# EAGLE design Pinguino-PIC18 (EAGLE 7.2.0)
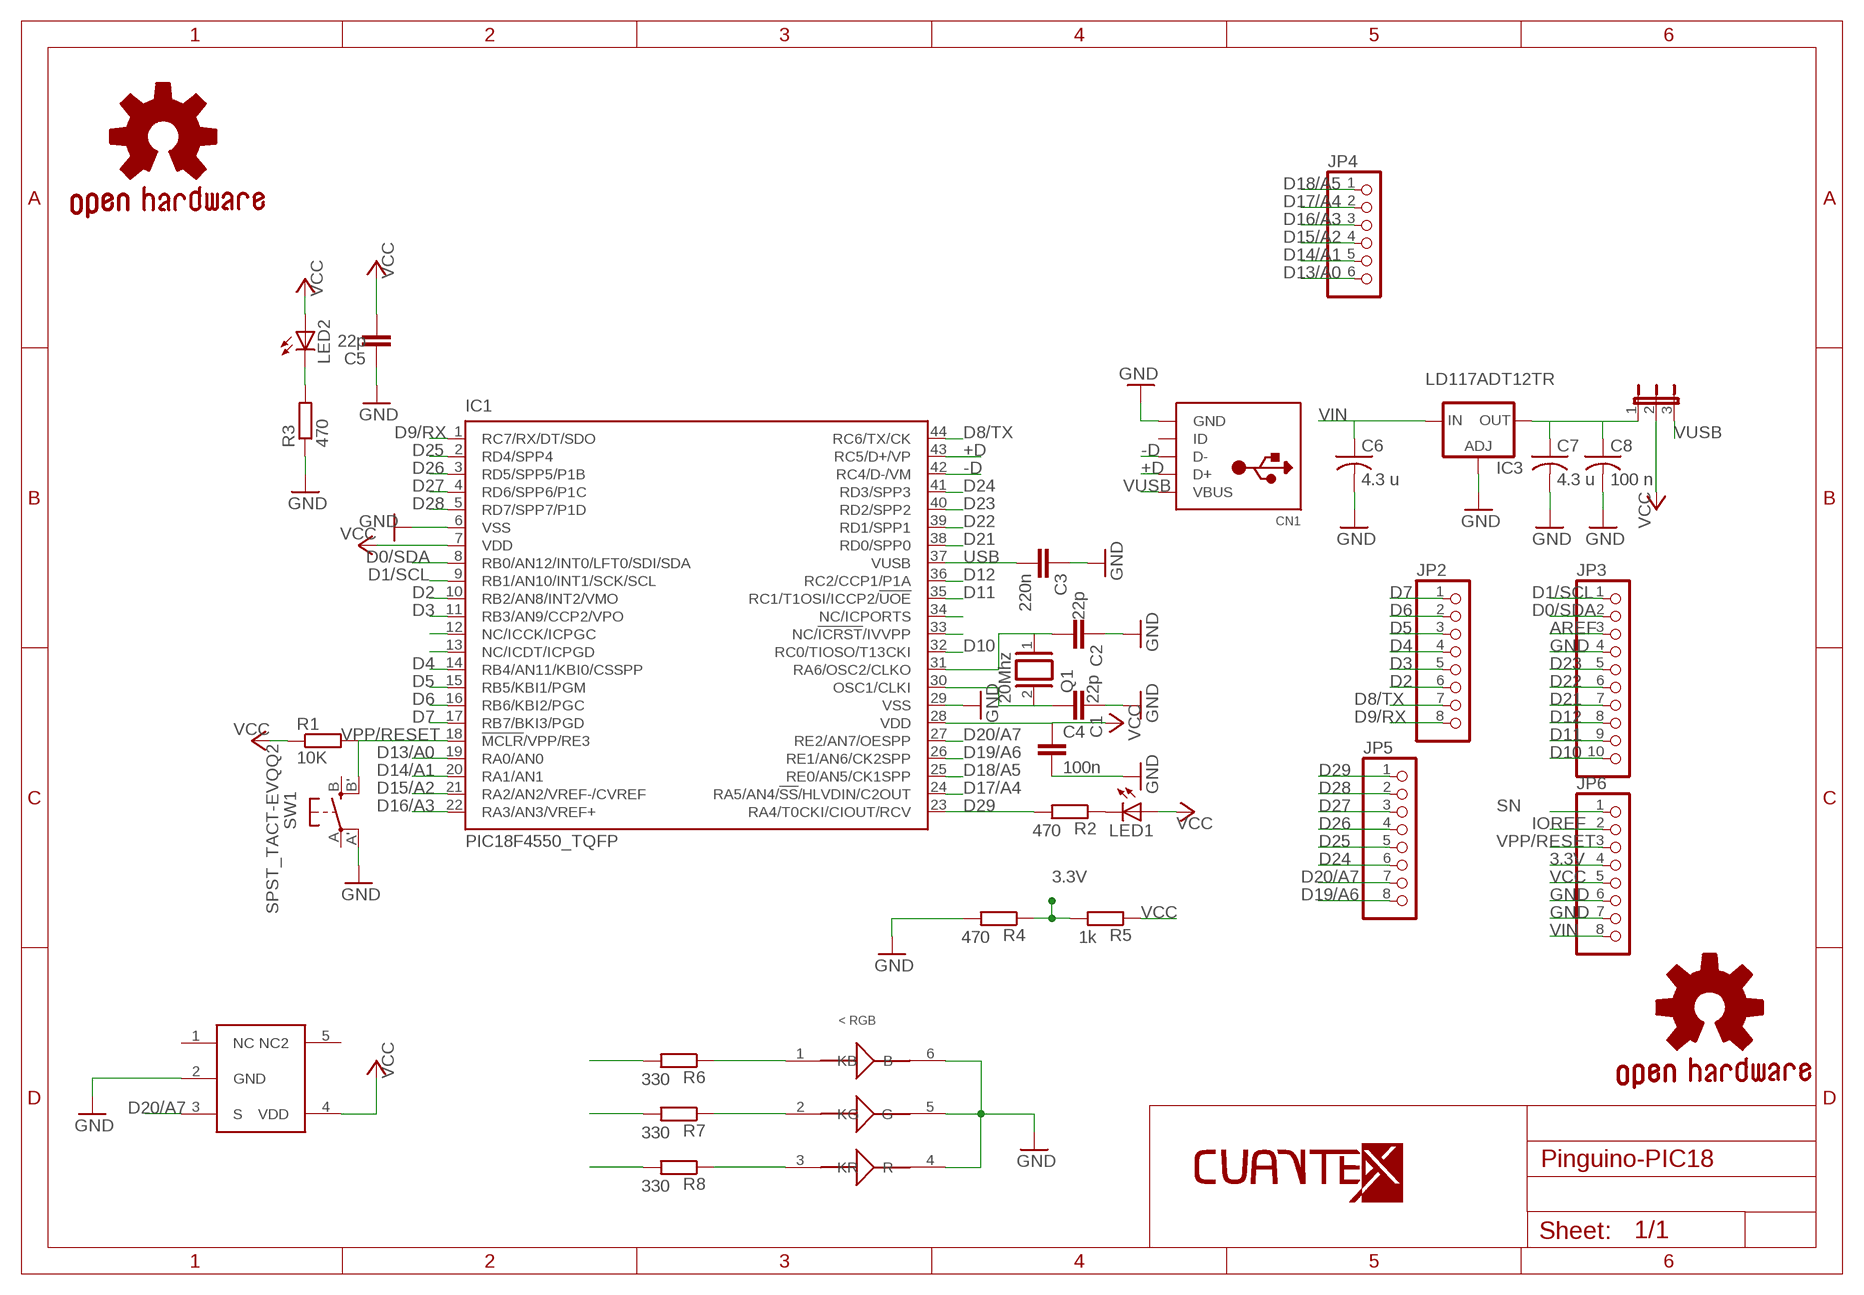
[diagram p0: schematic, sheet 1]

## Parts
C1  22p  CC0603  [C0603]
C2  22p  CC0603  [C0603]
C3  220n  CC0603  [C0603]
C4  100n  CC0603  [C0603]
C5  22p  CC0603  [C0603]
C6  4.3 u  C-USC1206K  [C1206K]
C7  4.3 u  C-USC1206K  [C1206K]
C8  100 n  C-USC0603K  [C0603K]
CN1  USBMINIB  [USB-MINIB]
GOLD_ORB_SM1  OSHWLOGO_GOLD_ORB_MED  [OSHW1]
GOLD_ORB_SM2  OSHWLOGO_GOLD_ORB_SM  [OSHW2]
IC1  PIC18F4550_TQFP  [TQFP44]
IC3  LD117ADT12TR  [DPACK]
JP1  JP2E  [JP2]
JP2  PINHD-1X8  [1X08]
JP3  PINHD-1X10  [1X10]
JP4  PINHD-1X6  [1X06]
JP5  PINHD-1X8  [1X08]
JP6  PINHD-1X8  [1X08]
LED1  LED_ESML0603  [LED_SML0603]
LED2  LED_ESML0603  [LED_SML0603]
Q1  20Mhz  XTAL/S  [QS]
R1  10K  RR0603  [R0603]
R2  470  RR0603  [R0603]
R3  470  RR0603  [R0603]
R4  470  RR0603  [R0603]
R5  1k  RR0603  [R0603]
R6  330  RR0603  [R0603]
R7  330  RR0603  [R0603]
R8  330  RR0603  [R0603]
SW1  SPST_TACT-EVQQ2  [EVQ-Q2]
U$1  LOGO-TOP-30MM  [C-1]
U$3  RGB_SMD  [SMD_LED]
U$4  SC70  [SC70]

## Nets
3.3V: JP6.4 R4.1 R5.2
+D: CN1.D+ IC1.43(RC5/D+/VP)
-D: CN1.D- IC1.42(RC4/D-/VM)
AREF: JP3.3
D0/SDA: IC1.8(RB0/AN12/INT0/LFT0/SDI/SDA) JP3.2
D1/SCL: IC1.9(RB1/AN10/INT1/SCK/SCL) JP3.1
D2: IC1.10(RB2/AN8/INT2/VMO) JP2.6
D3: IC1.11(RB3/AN9/CCP2/VPO) JP2.5 R6.2
D4: IC1.14(RB4/AN11/KBI0/CSSPP) JP2.4
D5: IC1.15(RB5/KBI1/PGM) JP2.3
D6: IC1.16(RB6/KBI2/PGC) JP2.2
D7: IC1.17(RB7/BKI3/PGD) JP2.1
D8/TX: IC1.44(RC6/TX/CK) JP2.7
D9/RX: IC1.1(RC7/RX/DT/SDO) JP2.8
D10: IC1.32(RC0/TIOSO/T13CKI) JP3.10
D11: IC1.35(RC1/T1OSI/ICCP2/!UOE) JP3.9
D12: IC1.36(RC2/CCP1/P1A) JP3.8 R7.2
D13/A0: IC1.19(RA0/AN0) JP4.6
D14/A1: IC1.20(RA1/AN1) JP4.5
D15/A2: IC1.21(RA2/AN2/VREF-/CVREF) JP4.4
D16/A3: IC1.22(RA3/AN3/VREF+) JP4.3
D17/A4: IC1.24(RA5/AN4/!SS!/HLVDIN/C2OUT) JP4.2
D18/A5: IC1.25(RE0/AN5/CK1SPP) JP4.1
D19/A6: IC1.26(RE1/AN6/CK2SPP) JP5.8
D20/A7: IC1.27(RE2/AN7/OESPP) JP5.7 U$4.3(S)
D21: IC1.38(RD0/SPP0) JP3.7 R8.2
D22: IC1.39(RD1/SPP1) JP3.6
D23: IC1.40(RD2/SPP2) JP3.5
D24: IC1.41(RD3/SPP3) JP5.6
D25: IC1.2(RD4/SPP4) JP5.5
D26: IC1.3(RD5/SPP5/P1B) JP5.4
D27: IC1.4(RD6/SPP6/P1C) JP5.3
D28: IC1.5(RD7/SPP7/P1D) JP5.2
D29: IC1.23(RA4/T0CKI/CIOUT/RCV) JP5.1 R2.2
GND: C1.1 C2.1 C3.1 C4.2 C5.1 C6.2 C7.2 C8.2 CN1.GND IC1.6(VSS) IC1.29(VSS) IC3.1(ADJ) JP3.4 JP6.6 JP6.7 R3.1 R4.2 SW1.A'(P1) U$3.4(R) U$3.5(G) U$3.6(B) U$4.2(GND)
IOREF: JP6.2
N$1: C1.2 IC1.30(OSC1/CLKI) Q1.2
N$3: C2.2 IC1.31(RA6/OSC2/CLKO) Q1.1
N$5: LED1.C R2.1
N$7: LED2.C R3.2
N$8: C7.1 C8.1 IC3.4(OUT) JP1.1
N$10: R6.1 U$3.1(KB)
N$11: R7.1 U$3.2(KG)
N$12: R8.1 U$3.3(KR)
N$45: IC1.12(NC/ICCK/ICPGC)
N$46: IC1.13(NC/ICDT/ICPGD)
N$47: IC1.34(NC/ICPORTS)
N$48: IC1.33(NC/!ICRST!/IVVPP)
SN: JP6.1
USB: C3.2 IC1.37(VUSB)
VCC: C4.1 C5.2 IC1.7(VDD) IC1.28(VDD) JP1.2 JP6.5 LED1.A LED2.A R1.1 R5.1 U$4.4(VDD)
VIN: C6.1 IC3.3(IN) JP6.8
VPP/RESET: IC1.18(!MCLR!/VPP/RE3) JP6.3 R1.2 SW1.B'(S1)
VUSB: CN1.VBUS JP1.3
Unconnected: CN1.ID SW1.A(P) SW1.B(S) U$4.1(NC) U$4.5(NC2)

## Library data of the parts
C1-C5 = eagle-ltspice:C: CAPACITOR, European symbol; SPICEMODEL: NONE; SPICEPREFIX: C
C6-C8 = adafruit:C-US: CAPACITOR, American symbol
CN1 = adafruit:USB: USB Connectors USBMINIB - Surface Mount Female Mini-B USB Connector 4UConnector: 06564 By microbuilder.eu Thru-hole RA Female Mini-B USB Connector 4UConnector: 18732 By ladyada.net
GOLD_ORB_SM1 GOLD_ORB_SM2 = OPENHW:OSHWLOGO: These are Open-Source Hardware logos.
IC1 = microchip:PIC18F4*_TQFP: USB Microcontrollers with nanoWatt Technology High-Performance, Enhanced Flash, 28/40/44-Pin, Source: http://ww1.microchip.com/downloads/en/devicedoc/39632c.pdf; MF: MICROCHIP; MPN: PIC18F4550-I/PT; OC_FARNELL: 9321365; OC_NEWARK: 08J9633
IC3 = v-reg:LD117A?*: Low drop fixed and adjustable positive voltage regulators 1 A Source: http://www.st.com/stonline/products/literature/ds/7194/ld1117axx.pdf
JP1 = jumper:JP2E: JUMPER
JP2 JP5 JP6 = pinhead:PINHD-1X8: PIN HEADER
JP3 = pinhead:PINHD-1X10: PIN HEADER
JP4 = pinhead:PINHD-1X6: PIN HEADER
LED1 LED2 = eagle-ltspice:LED_E: LED Source: http://www.osram.convergy.de Source: www.luxeon.com Source: www.kingbright.com; SPICEMODEL: NONE; SPICEPREFIX: D; SPICETYPE: diode
Q1 = special:XTAL/S: CRYSTAL
R1-R8 = eagle-ltspice:R: RESISTOR, European symbol; SPICEMODEL: NONE; SPICEPREFIX: R
SW1 = adafruit:SPST_TACT: SMT 6mm switch, EVQQ2 series http://www.ladyada.net/library/eagle
U$1 = LOGOTIPOS:LOGO-TOP-30MM
U$3 = RGB_smdHeTPro:RGB_SMD
U$4 = MCP9700:SC70: Sensor de Temperatura MCP9700 SC70 Rolando Ramiez Rosales HeTPro

## Board
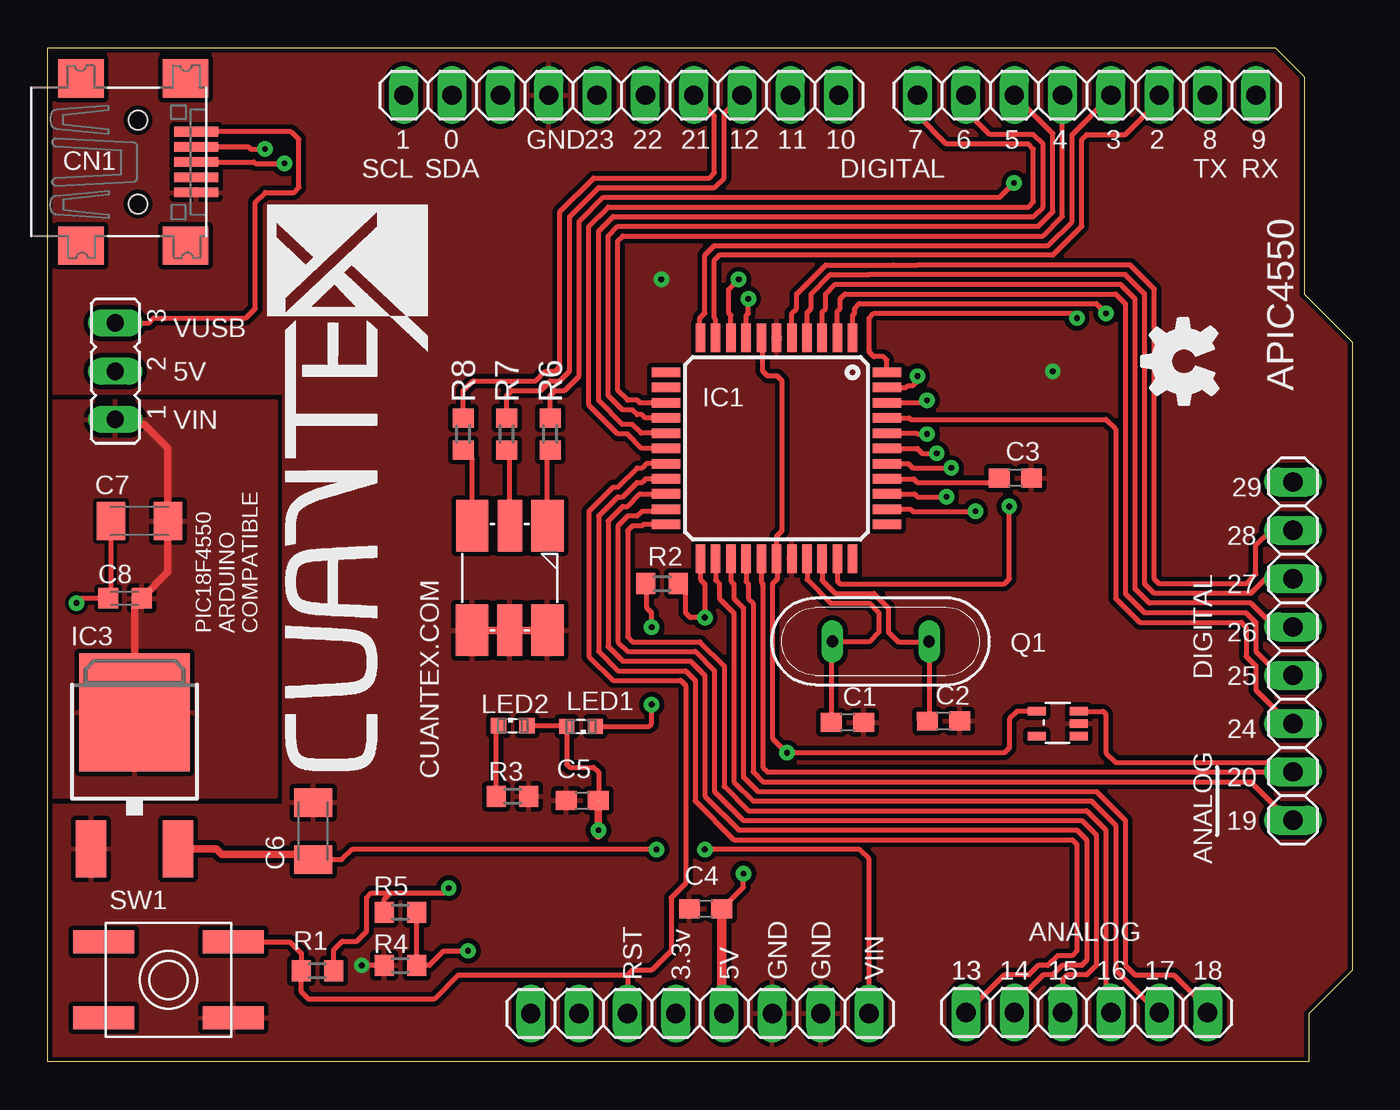
[diagram p1: board, top side]
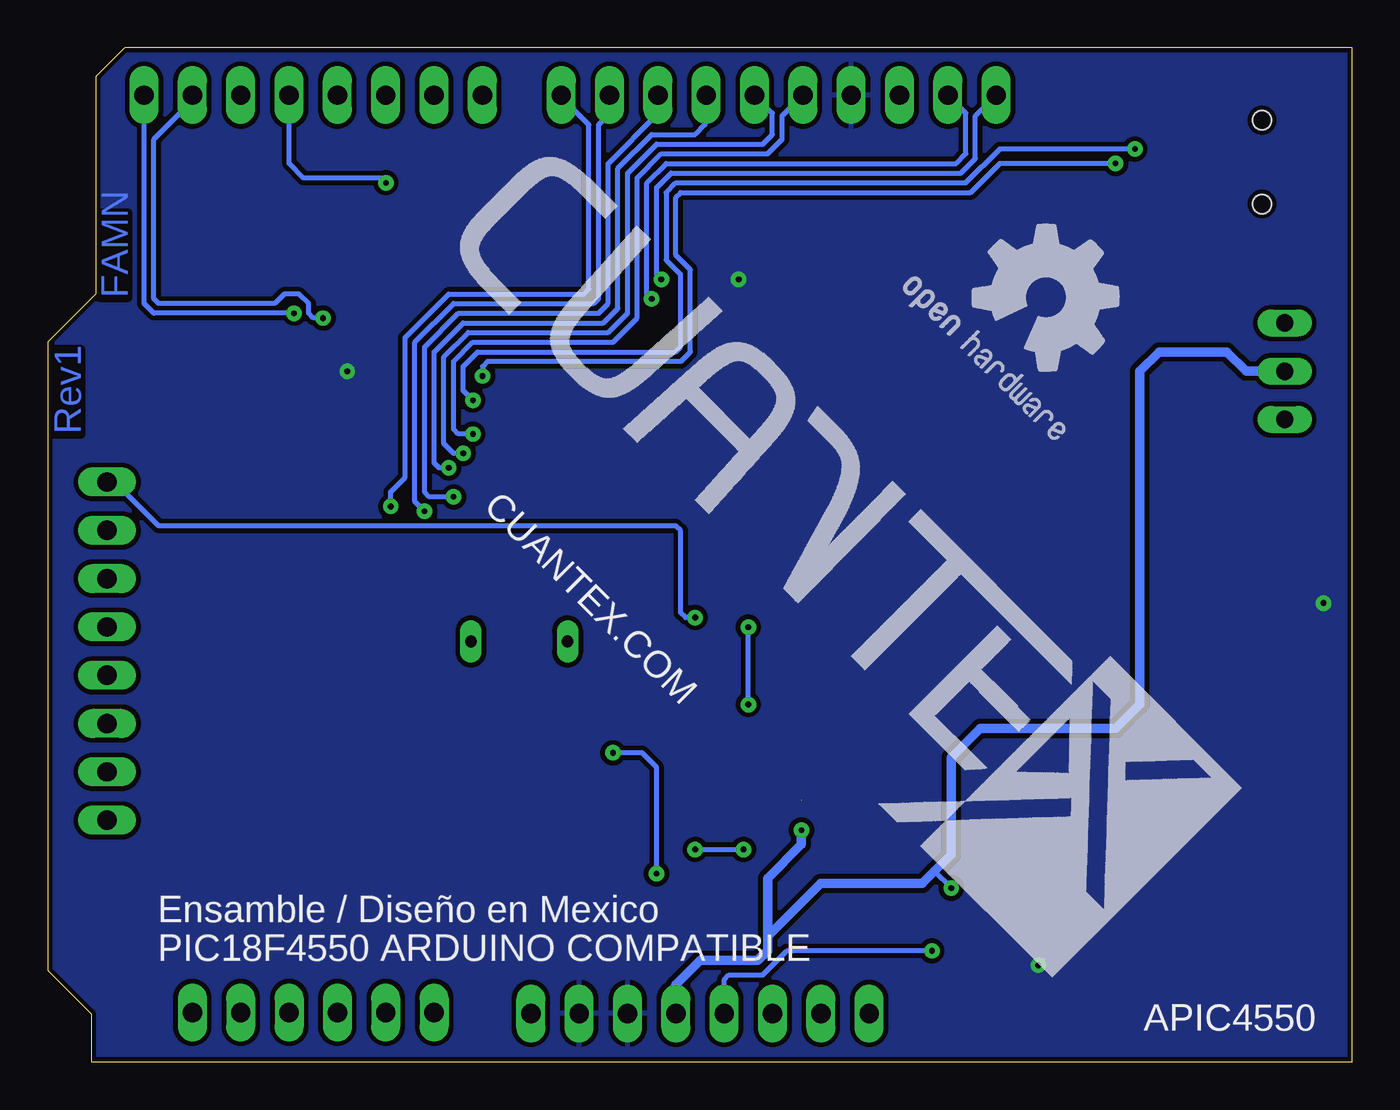
[diagram p2: board, bottom side, seen from below]

Size 68.58 x 53.34 mm. Coordinates in mm from the lower left corner, seen from the top.
Outline: 0,53.34 64.52,53.34 66.04,51.82 66.04,40.39 68.58,37.85 68.58,4.83 66.29,2.54 66.29,0 0,0 0,53.34
Copper layers (1*16): Top 0.035mm / dielectric 1.5mm / Bottom 0.035mm
Design rules "cuantex2layerdrc": minimum track width 8mil, minimum drill 0.3mm, track to track 8mil, track to pad 8mil, pad to pad 8mil, via to via 8mil, smd to smd 8mil, copper to edge 10mil, drill to drill 10mil, minimum pad ring 10mil, minimum via ring 10mil, stop-mask expansion 4mil, vias tented up to drill 0mil, thermal gap 10mil

### Footprints (pad centres in the part's own frame; a part is rotated, then mirrored left to right if it is on the bottom)
C0603 = smd 1.1 x 1: 1 -0.85,0; 2 0.85,0
C1206K = smd 1.5 x 2: 1 -1.5,0; 2 1.5,0
C0603K = smd 1.05 x 1.08: 1 -0.875,0; 2 0.875,0
USB-MINIB = smd 0.5 x 2.308: D+ 0,4.064; D- -0.8,4.064; GND 1.6,4.064; ID 0.8,4.064; VBUS -1.6,4.064 | smd 2 x 2.4: GND1 -4.4,-2; GND2 -4.4,3.5; GND3 4.4,3.5; GND4 4.4,-2 | hole 1: -2.2,1; 2.2,1
TQFP44 = smd 1.5 x 0.5: 1 -5.8,4; 2 -5.8,3.2; 3 -5.8,2.4; 4 -5.8,1.6; 5 -5.8,0.8; 6 -5.8,0; 7 -5.8,-0.8; 8 -5.8,-1.6; 9 -5.8,-2.4; 10 -5.8,-3.2; 11 -5.8,-4; 23 5.8,-4; 24 5.8,-3.2; 25 5.8,-2.4; 26 5.8,-1.6; 27 5.8,-0.8; 28 5.8,0; 29 5.8,0.8; 30 5.8,1.6; 31 5.8,2.4; 32 5.8,3.2; 33 5.8,4 | smd 0.5 x 1.5: 12 -4,-5.8; 13 -3.2,-5.8; 14 -2.4,-5.8; 15 -1.6,-5.8; 16 -0.8,-5.8; 17 0,-5.8; 18 0.8,-5.8; 19 1.6,-5.8; 20 2.4,-5.8; 21 3.2,-5.8; 22 4,-5.8; 34 4,5.8; 35 3.2,5.8; 36 2.4,5.8; 37 1.6,5.8; 38 0.8,5.8; 39 0,5.8; 40 -0.8,5.8; 41 -1.6,5.8; 42 -2.4,5.8; 43 -3.2,5.8; 44 -4,5.8
DPACK = smd 1.6 x 3: 1 -2.28,-4.8; 3 2.28,-4.8 | smd 5.8 x 6.2: 4 0,2.38
JP2 = drill 0.914 long: 1 -2.54,0; 2 0,0; 3 2.54,0
1X08 = drill 1.016 long: 1 -8.89,0; 2 -6.35,0; 3 -3.81,0; 4 -1.27,0; 5 1.27,0; 6 3.81,0; 7 6.35,0; 8 8.89,0
1X10 = drill 1.016 long: 1 -11.43,0; 2 -8.89,0; 3 -6.35,0; 4 -3.81,0; 5 -1.27,0; 6 1.27,0; 7 3.81,0; 8 6.35,0; 9 8.89,0; 10 11.43,0
1X06 = drill 1.016 long: 1 -6.35,0; 2 -3.81,0; 3 -1.27,0; 4 1.27,0; 5 3.81,0; 6 6.35,0
LED_SML0603 = smd 0.8 x 0.8: A 0.75,0; C -0.75,0
QS = drill 0.61 long: 1 -2.54,0; 2 2.54,0
R0603 = smd 1 x 1.1: 1 -0.85,0; 2 0.85,0
EVQ-Q2 = smd 3.2 x 1.2: A -3.4,-2; A' 3.4,-2; B -3.4,2; B' 3.4,2
SMD_LED = smd 2.7 x 1.7: 1 -2.8,1.89; 3 -2.8,-2.06; 4 2.7,-2.07; 6 2.7,1.89 | smd 2.7 x 1.3: 2 -2.8,-0.08; 5 2.7,-0.09
SC70 = smd 0.45 x 0.95: 1 0.64,1.11; 2 -0.01,1.11; 3 -0.66,1.11; 4 -0.66,-1.09; 5 0.64,-1.09

### Placement (x,y rotation side)
C1  42.04,17.86 180 top
C2  47.09,17.93 180.4 top
C3  50.86,30.71 180 top
C4  34.59,8.05 180 top
C5  28.1,13.75 0 top
C6  13.96,12.15 90 top
C7  4.83,28.45 180 top
C8  4.06,24.38 180 top
CN1  3.75,47.32 270 top
GOLD_ORB_SM1  25.65,39.67 315 bottom
GOLD_ORB_SM2  64.01,33.02 90 top
IC1  38.31,32.26 270 top
IC3  4.57,16 0 top
JP1  3.56,36.32 90 top
JP2  54.62,50.84 0 top
JP3  30.15,50.84 0 top
JP4  54.62,2.61 180 top
JP5  65.45,21.6 270 top
JP6  34.29,2.56 0 top
LED1  28.03,17.64 180 top
LED2  24.45,17.69 0 top
Q1  43.79,22.11 180 top
R1  14.18,4.8 180 top
R2  32.3,25.15 0 top
R3  24.44,13.97 180 top
R4  18.54,5.08 180 top
R5  18.54,7.87 0 top
R6  26.42,33.02 90 top
R7  24.13,33.02 90 top
R8  21.84,33.02 90 top
SW1  6.35,4.32 0 top
U$1  20.07,15.24 90 top
U$2  LOGO-TOP-40MM  [C-3]  51.15,39.64 315 bottom
U$3  24.38,25.4 270 top
U$4  53.09,17.78 270 top

### Tracks (layer width: path | path; a pad name or v marks a point on that pad's centre or on a via)
3.3V  (via drill 0.3)
  Top 0.254: v22.1,5.84 20.83,5.84 20.07,5.08 R4.1 R5.2
  Bottom 0.254: JP6.4 33.02,4.32 32.77,4.57 30.99,4.57 29.72,5.84 v22.1,5.84
+D  (via drill 0.3)
  Top 0.254: CN1.D+ 10.85,47.31 10.92,47.24 v12.45,47.24 | IC1.43 45.12,35.47 45.21,35.56 45.47,35.56 45.72,35.81 v45.72,36.07
  Bottom 0.254: v12.45,47.24 18.54,47.24 20.07,45.72 35.31,45.72 35.56,45.47 35.56,42.42 34.8,41.66 34.8,37.34 35.31,36.83 45.47,36.83 45.72,36.58 v45.72,36.07
-D  (via drill 0.3)
  Top 0.254: IC1.42 46.09,34.66 v46.23,34.8 | CN1.D- 10.56,48.12 10.67,48.01 v11.43,48.01
  Bottom 0.254: v11.43,48.01 18.54,48.01 20.32,46.23 35.56,46.23 36.07,45.72 36.07,42.16 35.31,41.4 35.31,37.59 35.56,37.34 45.97,37.34 46.74,36.58 46.74,35.31 v46.23,34.8
D0/SDA  (via drill 0.3)
  Top 0.254: IC1.8 36.71,39.25 36.83,39.37 v36.83,40.13
  Bottom 0.254: v36.83,40.13 37.08,40.39 37.08,46.23 36.07,47.24 20.83,47.24 20.32,47.75 20.32,49.89 JP3.2
D1/SCL  (via drill 0.3)
  Top 0.254: IC1.9 35.91,39.27 35.81,39.37 35.81,40.64 v36.32,41.15
  Bottom 0.254: JP3.1 19.81,49.75 19.81,47.5 20.57,46.74 35.81,46.74 36.58,45.97 36.58,41.4 v36.32,41.15
D2
  Top 0.254: IC1.10 35.11,39.05 35.05,39.12 35.05,42.16 35.31,42.42 52.83,42.42 54.36,43.94 54.36,48.51 54.61,48.77 56.64,48.77 58.43,50.56 JP2.6
D3  (via drill 0.3)
  Top 0.254: IC1.11 34.31,38.08 34.29,38.1 34.29,39.12 34.54,39.37 34.54,42.42 35.05,42.93 52.58,42.93 53.85,44.2 53.85,48.77 55.89,50.81 JP2.5 55.88,50.83 | R6.2 26.42,35.05 26.67,35.31 27.18,35.31 27.94,36.07 27.94,44.2 29.21,45.47 50.04,45.47 v50.8,46.23
  Bottom 0.254: v50.8,46.23 51.05,46.48 55.12,46.48 55.89,47.25 JP2.5
D4
  Top 0.254: JP2.4 53.34,50.83 53.34,44.45 52.32,43.43 30.23,43.43 29.97,43.18 29.97,35.31 30.48,34.8 30.99,34.8 31.12,34.66 IC1.14
D5
  Top 0.254: JP2.3 52.83,48.81 52.83,44.7 52.07,43.94 29.97,43.94 29.46,43.43 29.46,35.05 30.23,34.29 30.73,34.29 30.99,34.04 31.24,34.04 31.41,33.87 IC1.15
D6
  Top 0.254: IC1.16 31.2,33.06 30.73,33.53 30.23,33.53 28.96,34.8 28.96,43.69 29.72,44.45 51.82,44.45 52.32,44.96 52.32,48.26 51.82,48.77 49.53,48.77 48.27,50.03 JP2.2
D7
  Top 0.254: IC1.17 31.23,32.27 30.48,33.02 29.97,33.02 28.45,34.54 28.45,43.94 29.46,44.96 51.56,44.96 51.82,45.21 51.82,48.01 51.56,48.26 47.24,48.26 45.73,49.77 JP2.1
D8/TX  (via drill 0.3)
  Top 0.254: IC1.44 44.11,36.91 43.94,37.08 43.43,37.08 43.18,37.34 43.18,39.12 43.43,39.37 53.85,39.37 v54.1,39.12
  Bottom 0.254: JP2.7 61.47,50.34 61.47,50.04 62.99,48.51 62.99,40.13 62.74,39.88 56.64,39.88 56.13,40.39 55.37,40.39 54.86,39.88 54.86,39.37 54.61,39.12 v54.1,39.12
D9/RX  (via drill 0.3)
  Top 0.254: IC1.1 42.31,39.27 42.42,39.37 42.42,39.62 42.67,39.88 55.12,39.88 v55.63,39.37
  Bottom 0.254: JP2.8 63.5,50.83 63.5,39.88 62.99,39.37 v55.63,39.37
D10  (via drill 0.3)
  Top 0.254: IC1.32 41.51,25.29 41.66,25.15 50.29,25.15 50.55,25.4 v50.55,29.21
  Bottom 0.254: JP3.10 41.58,50.73 40.13,49.28 40.13,40.64 40.39,40.39 47.5,40.39 49.78,38.1 49.78,30.73 50.55,29.97 v50.55,29.21
D11  (via drill 0.3)
  Top 0.254: IC1.35 45.36,29.07 45.47,28.96 v48.77,28.96
  Bottom 0.254: v48.77,28.96 49.28,29.46 49.28,37.85 47.24,39.88 39.88,39.88 39.62,40.13 39.62,49.28 39.04,49.86 JP3.9
D12  (via drill 0.3)
  Top 0.254: IC1.36 45.57,29.87 45.72,29.72 v47.24,29.72 | R7.2 24.13,35.05 24.38,35.31 25.91,35.31 26.42,35.81 26.92,35.81 27.43,36.32 27.43,44.45 28.96,45.97 35.05,45.97 35.56,46.48 35.56,49.89 JP3.8
  Bottom 0.254: v47.24,29.72 48.51,29.72 48.77,29.97 48.77,37.59 46.99,39.37 39.62,39.37 39.12,39.88 39.12,47.24 36.5,49.86 JP3.8
D13/A0
  Top 0.254: IC1.19 31.43,30.66 31.24,30.48 30.99,30.48 30.23,29.72 29.97,29.72 28.96,28.7 28.96,21.59 29.97,20.57 33.53,20.57 34.04,20.07 34.04,13.72 36.07,11.68 53.85,11.68 54.1,11.43 54.1,5.84 53.85,5.59 53.09,5.59 52.58,5.08 52.07,5.08 51.56,4.57 50.29,4.57 48.77,3.05 48.71,3.05 JP4.6
D14/A1
  Top 0.254: IC1.20 31.13,29.87 30.48,29.21 30.23,29.21 29.46,28.45 29.46,21.84 30.23,21.08 33.78,21.08 34.54,20.32 34.54,13.97 36.32,12.19 54.1,12.19 54.61,11.68 54.61,5.33 54.36,5.08 53.34,5.08 52.83,4.57 52.32,4.57 50.8,3.05 JP4.5
D15/A2
  Top 0.254: IC1.21 32.41,28.96 31.24,28.96 30.99,28.7 30.48,28.7 29.97,28.19 29.97,22.1 30.48,21.59 34.04,21.59 35.05,20.57 35.05,14.22 36.58,12.7 54.36,12.7 55.12,11.94 55.12,5.08 54.61,4.57 53.59,4.57 53.34,4.32 53.35,4.31 JP4.4
D16/A3
  Top 0.254: IC1.22 31.31,28.27 31.24,28.19 30.73,28.19 30.48,27.94 30.48,22.35 30.73,22.1 34.29,22.1 35.56,20.83 35.56,14.48 36.83,13.21 54.61,13.21 55.63,12.19 55.63,2.87 JP4.3
D17/A4
  Top 0.254: IC1.24 35.11,25.34 35.31,25.15 35.31,24.38 36.07,23.62 36.07,14.73 37.08,13.72 54.86,13.72 56.13,12.45 56.13,4.83 58.35,2.61 JP4.2
D18/A5
  Top 0.254: IC1.25 35.91,25.3 36.07,25.15 36.07,24.38 36.58,23.88 36.58,14.99 37.34,14.22 55.12,14.22 56.64,12.7 56.64,5.08 57.15,4.57 59.18,4.57 60.97,2.78 JP4.1
D19/A6
  Top 0.254: IC1.26 36.71,25.26 36.83,25.15 36.83,24.38 37.08,24.13 37.08,15.24 37.59,14.73 63.25,14.73 64.77,13.21 64.95,13.21 JP5.8
D20/A7
  Top 0.254: IC1.27 37.51,25.22 37.59,25.15 37.59,15.49 37.85,15.24 65.43,15.24 JP5.7 64.95,15.75 56.13,15.75 55.63,16.26 55.63,18.29 55.47,18.44 U$4.3
D21  (via drill 0.3)
  Top 0.254: IC1.38 45.24,31.47 45.47,31.24 v47.5,31.24 | R8.2 21.84,35.31 22.35,35.81 25.65,35.81 26.16,36.32 26.67,36.32 26.92,36.58 26.92,44.7 28.7,46.48 34.8,46.48 35.05,46.74 35.05,49.75 JP3.7
  Bottom 0.254: v47.5,31.24 48.01,31.24 48.26,31.5 48.26,37.34 46.74,38.86 39.37,38.86 38.61,39.62 38.61,46.99 36.83,48.77 34.54,48.77 34.04,49.28 34.04,50.76 JP3.7
D22  (via drill 0.3)
  Top 0.254: IC1.39 45.71,32.27 45.97,32 v46.74,32
  Bottom 0.254: v46.74,32 47.24,32 47.75,32.51 47.75,37.08 46.48,38.35 39.12,38.35 38.1,39.37 38.1,46.74 36.58,48.26 30.99,48.26 30.48,48.77 30.48,49.89 JP3.6
D23  (via drill 0.3)
  Top 0.254: IC1.40 45.68,33.06 45.72,33.02 v46.23,33.02
  Bottom 0.254: v46.23,33.02 46.99,33.02 47.24,33.27 47.24,36.83 46.23,37.85 38.86,37.85 37.59,39.12 37.59,46.48 36.32,47.75 30.73,47.75 29.97,48.51 29.97,49.75 JP3.5
D24
  Top 0.254: IC1.41 45.3,33.87 45.38,33.78 55.63,33.78 56.13,33.27 56.13,24.38 57.4,23.11 62.74,23.11 62.99,22.86 62.99,21.34 63.5,20.83 63.5,19.56 64.77,18.29 64.95,18.29 JP5.6
D25
  Top 0.254: IC1.2 41.51,39.48 41.66,39.62 41.66,40.13 41.91,40.39 56.13,40.39 56.64,39.88 56.64,24.64 57.66,23.62 62.99,23.62 63.5,23.11 63.5,21.59 64.75,20.34 JP5.5
D26
  Top 0.254: IC1.3 40.71,39.44 40.89,39.62 40.89,40.39 41.4,40.89 56.39,40.89 57.15,40.13 57.15,24.89 57.91,24.13 63.25,24.13 64.5,22.88 JP5.4 65.43,22.86
D27
  Top 0.254: IC1.4 39.91,39.41 40.13,39.62 40.13,40.39 41.15,41.4 41.4,41.4 43.18,41.4 56.64,41.4 57.66,40.39 57.66,25.15 58.17,24.64 63.25,24.64 64.02,25.41 JP5.3
D28
  Top 0.254: IC1.5 39.11,39.37 39.37,39.62 39.37,40.39 40.89,41.91 44.45,41.91 45.72,41.91 56.9,41.91 58.17,40.64 58.17,25.4 58.42,25.15 62.99,25.15 63.5,25.65 63.5,27.18 64.28,27.96 JP5.2
D29  (via drill 0.3)
  Top 0.254: IC1.23 34.31,25.38 34.54,25.15 v34.54,23.37 33.78,23.37 33.53,23.62 33.53,24.77 R2.2
  Bottom 0.254: v34.54,23.37 35.05,23.37 35.31,23.62 35.31,27.94 35.56,28.19 62.74,28.19 65.04,30.49 JP5.1
GND  (via drill 0.3)
  Top 0.254: C6.2 13.96,13.47 | R4.2 v16.51,5.08 | C7.2 3.33,24.52 C8.2 1.78,24.38 v1.52,24.13
  Top 0.406: U$3.4 U$3.6
  Bottom 0.254: v16.51,5.08 16.26,5.33
  other vias: 32.26,41.15 52.83,36.32
  pour Bottom (isolate 0.254): -0.54,53.46 68.46,53.46 68.46,-0.54 -0.54,-0.54
  pour Top (isolate 0.254): -0.54,53.46 68.46,53.46 68.46,-0.54 -0.54,-0.54 -0.54,13.48 12.46,13.48 12.46,35.21 -0.54,35.21
N$1
  Top 0.254: IC1.30 39.91,25.36 41.15,24.13 43.18,24.13 43.69,23.62 43.69,22.61 43.18,22.1 41.26,22.1 Q1.2 41.19,22.06 C1.2
N$3
  Top 0.254: IC1.31 40.71,25.33 41.4,24.64 43.43,24.64 44.2,23.88 44.2,22.61 44.7,22.1 46.31,22.1 Q1.1 46.33,18.01 C2.2
N$5  (via drill 0.3)
  Top 0.254: LED1.C 31.61,17.64 31.75,17.78 v31.75,18.8 | v31.75,22.86 31.75,23.62 31.5,23.88 31.5,25.1 R2.1
  Bottom 0.254: v31.75,18.8 v31.75,22.86
N$7
  Top 0.254: R3.2 23.59,17.58 LED2.C
N$8
  Top 0.406: IC3.4 4.57,24.02 C8.1 6.33,25.77 C7.1 6.33,32.28 5.08,33.53 3.81,33.53 JP1.1
  pour Top: -0.03,34.71 11.97,34.71 11.97,13.97 0.22,13.97
N$10
  Top 0.254: U$3.1 26.27,32.03 R6.1
N$11
  Top 0.254: U$3.2 24.3,32 R7.1
N$12
  Top 0.254: U$3.3 22.32,31.69 R8.1
USB
  Top 0.254: IC1.37 45.54,30.66 45.72,30.48 49.78,30.48 C3.2
VCC  (via drill 0.3)  (1 unrouted)
  Top 0.254: IC1.7 37.59,37.99 37.59,36.32 37.85,36.07 38.35,36.07 38.61,35.81 38.61,27.94 38.31,27.65 IC1.28 38.35,26.43 38.35,25.4 38.1,25.15 38.1,17.02 v38.86,16.26 50.29,16.26 50.55,16.51 50.55,18.03 50.95,18.44 U$4.4 | LED2.A 27.23,17.69 LED1.A 27.28,15.65 27.43,15.49 28.7,15.49 28.96,15.24 C5.2 | R1.1 15.04,5.89 15.49,6.35 16.26,6.35 16.76,6.86 16.76,8.64 17.02,8.89 18.03,8.89 | 18.03,8.89 20.83,8.89 v21.08,9.14 | R5.1 17.69,8.55 18.03,8.89 | C4.1 36.58,9.19 v36.58,9.91
  Top 0.406: v28.96,12.19 v28.95,12.19 C5.2
  Top 0.508: C4.1 35.44,2.68 JP6.5 | v28.96,12.19 28.95,11.94
  Bottom 0.254: v21.08,9.14 21.97,10.03 | v36.58,9.91 36.58,15.49 37.34,16.26 v38.86,16.26
  Bottom 0.508: 30.73,6.6 30.73,9.65 28.96,11.43 v28.96,12.19 | JP6.5 35.56,4.07 34.29,5.33 31.24,5.33 30.73,5.84 30.73,6.6 | JP1.2 5.59,36.32 6.6,37.34 10.16,37.34 11.18,36.32 11.18,18.8 12.45,17.53 19.56,17.53 21.08,16 21.08,10.92 21.97,10.03 22.61,9.4 27.94,9.4 30.73,6.6
VIN  (via drill 0.3)
  Top 0.254: JP6.8 43.18,10.67 42.67,11.18 v34.54,11.18 | C6.1 15.47,10.65 16,11.18 v32,11.18
  Top 0.406: IC3.3 8.86,11.2 9.14,10.92 13.69,10.92 C6.1
  Bottom 0.254: v34.54,11.18 v32,11.18
VPP/RESET
  Top 0.254: IC1.18 31.47,31.47 31.24,31.24 30.99,31.24 29.97,30.23 29.72,30.23 28.45,28.96 28.45,21.34 29.72,20.07 33.27,20.07 33.53,19.81 33.53,9.4 32.77,8.64 32.77,5.84 31.75,4.83 30.73,4.83 30.48,4.57 | 30.48,4.57 JP6.3 | 30.48,4.57 21.59,4.57 20.32,3.3 13.72,3.3 13.33,3.68 R1.2 13.33,5.72 12.73,6.32 SW1.B'
VUSB
  Top 0.254: JP1.3 5.33,38.86 5.59,39.12 10.41,39.12 10.92,39.62 10.92,45.21 11.43,45.72 12.95,45.72 13.21,45.97 13.21,48.51 12.81,48.91 CN1.VBUS

### Text on the board
Bottom: FAMN | Rev1
tPlace: APIC4550 | PIC18F4550 / ARDUINO / COMPATIBLE
tNames: 1 | 0 | GND | 23 | 22 | 21 | 12 | 11 | 10 | 7 | 6 | 5 | 4 | 3 | 2 | 8 | 9 | SCL | SDA | DIGITAL | TX | RX | VUSB | 5V | VIN | 29 | 28 | CUANTEX.COM | DIGITAL | 27 | 26 | 25 | 24 | 20 | 19 | ANALOG | ANALOG | RST | 3.3v | 5V | GND | GND | VIN | 13 | 13 | 14 | 15 | 16 | 17 | 18
bNames: CUANTEX.COM | Ensamble / Diseño en Mexico | PIC18F4550 ARDUINO COMPATIBLE | APIC4550